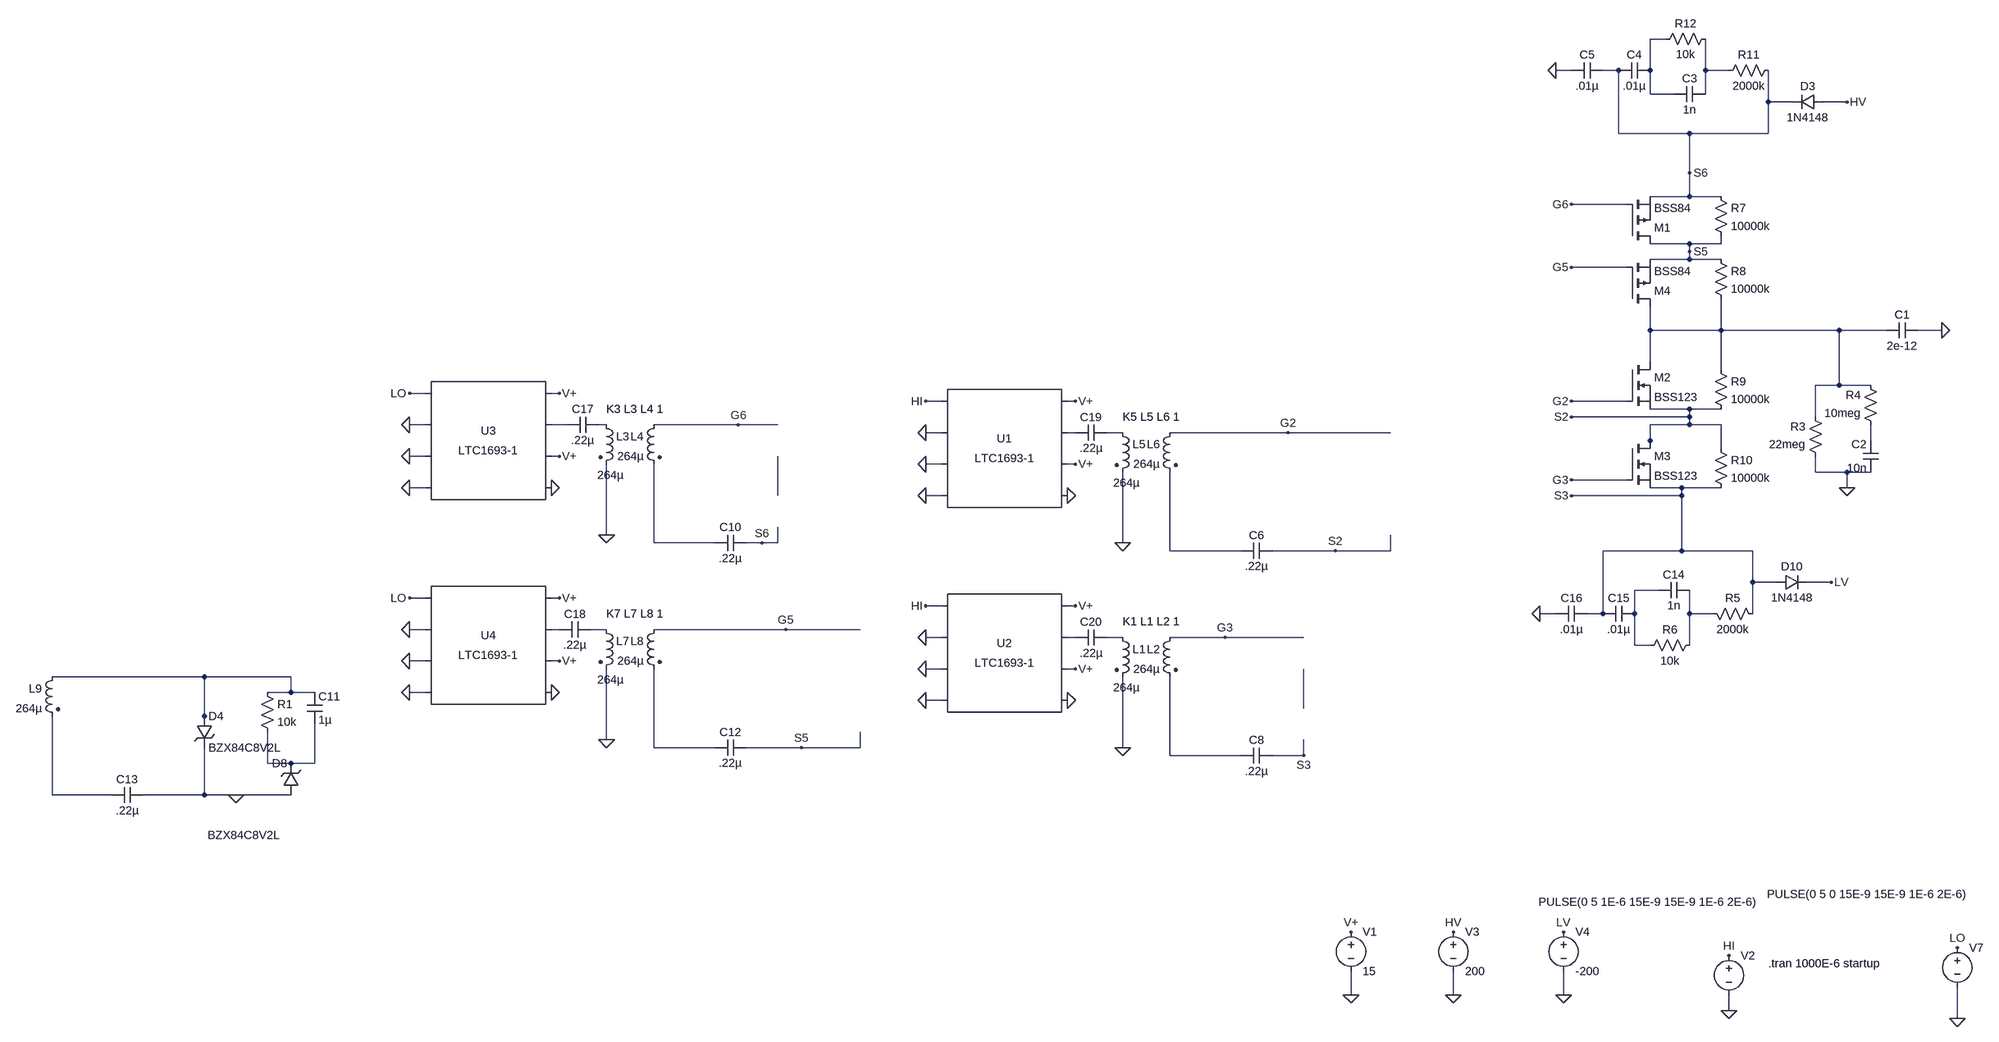
[diagram p0: schematic halfbridge_implant.asc]
halfbridge_implant.asc, the LTspice schematic file:
Version 4
SHEET 1 1824 692
WIRE 16 -2000 -16 -2000
WIRE -176 -1936 -208 -1936
WIRE -80 -1936 -112 -1936
WIRE -16 -1936 -16 -2000
WIRE 96 -1936 96 -2000
WIRE 144 -1936 96 -1936
WIRE -16 -1888 -16 -1936
WIRE 32 -1888 -16 -1888
WIRE 96 -1888 96 -1936
WIRE 224 -1872 224 -1936
WIRE 272 -1872 224 -1872
WIRE 384 -1872 336 -1872
WIRE -80 -1808 -80 -1936
WIRE 64 -1808 -80 -1808
WIRE 224 -1808 224 -1872
WIRE 224 -1808 64 -1808
WIRE 64 -1728 64 -1808
WIRE 64 -1680 64 -1728
WIRE 64 -1680 -16 -1680
WIRE 128 -1680 64 -1680
WIRE -64 -1664 -176 -1664
WIRE 64 -1584 -16 -1584
WIRE 128 -1584 128 -1600
WIRE 128 -1584 64 -1584
WIRE 64 -1568 64 -1584
WIRE 64 -1552 64 -1568
WIRE 64 -1552 -16 -1552
WIRE 128 -1552 64 -1552
WIRE -64 -1536 -176 -1536
WIRE -16 -1408 -16 -1456
WIRE 128 -1408 128 -1472
WIRE 128 -1408 -16 -1408
WIRE 368 -1408 128 -1408
WIRE 464 -1408 368 -1408
WIRE 576 -1408 528 -1408
WIRE -16 -1344 -16 -1408
WIRE 128 -1328 128 -1408
WIRE 368 -1296 368 -1408
WIRE 368 -1296 320 -1296
WIRE 432 -1296 368 -1296
WIRE -2688 -1280 -2720 -1280
WIRE -2416 -1280 -2432 -1280
WIRE -1456 -1264 -1488 -1264
WIRE -1184 -1264 -1200 -1264
WIRE -64 -1264 -176 -1264
WIRE 64 -1248 -16 -1248
WIRE 128 -1248 64 -1248
WIRE 64 -1232 64 -1248
WIRE 64 -1232 -176 -1232
WIRE 320 -1232 320 -1296
WIRE -2688 -1216 -2720 -1216
WIRE -2400 -1216 -2432 -1216
WIRE -2320 -1216 -2336 -1216
WIRE -2032 -1216 -2224 -1216
WIRE -1952 -1216 -2032 -1216
WIRE 64 -1216 64 -1232
WIRE 64 -1216 -16 -1216
WIRE 128 -1216 64 -1216
WIRE -1456 -1200 -1488 -1200
WIRE -1184 -1200 -1200 -1200
WIRE -1088 -1200 -1120 -1200
WIRE -752 -1200 -992 -1200
WIRE -544 -1200 -752 -1200
WIRE -16 -1184 -16 -1216
WIRE 432 -1184 432 -1216
WIRE -16 -1168 -16 -1184
WIRE 128 -1168 128 -1216
WIRE -2688 -1152 -2720 -1152
WIRE -2416 -1152 -2432 -1152
WIRE -1456 -1136 -1488 -1136
WIRE -1184 -1136 -1200 -1136
WIRE 320 -1120 320 -1152
WIRE 384 -1120 320 -1120
WIRE 432 -1120 384 -1120
WIRE -64 -1104 -176 -1104
WIRE -2688 -1088 -2720 -1088
WIRE 48 -1088 -16 -1088
WIRE 128 -1088 48 -1088
WIRE 384 -1088 384 -1120
WIRE -1952 -1072 -1952 -1152
WIRE -1456 -1072 -1488 -1072
WIRE 48 -1072 48 -1088
WIRE 48 -1072 -176 -1072
WIRE -2320 -992 -2320 -1136
WIRE -2224 -976 -2224 -1136
WIRE -2080 -976 -2224 -976
WIRE -1984 -976 -2016 -976
WIRE -1952 -976 -1952 -1008
WIRE -1952 -976 -1984 -976
WIRE -1088 -976 -1088 -1120
WIRE -992 -960 -992 -1120
WIRE -848 -960 -992 -960
WIRE -656 -960 -784 -960
WIRE -544 -960 -544 -992
WIRE -544 -960 -656 -960
WIRE 48 -960 48 -1072
WIRE 48 -960 -112 -960
WIRE 192 -960 48 -960
WIRE 192 -896 192 -960
WIRE 240 -896 192 -896
WIRE 352 -896 304 -896
WIRE 0 -880 -48 -880
WIRE -2688 -864 -2720 -864
WIRE -2416 -864 -2432 -864
WIRE -1456 -848 -1488 -848
WIRE -1184 -848 -1200 -848
WIRE -208 -832 -240 -832
WIRE -112 -832 -112 -960
WIRE -112 -832 -144 -832
WIRE -48 -832 -48 -880
WIRE 64 -832 64 -880
WIRE 112 -832 64 -832
WIRE 192 -832 192 -896
WIRE -2688 -800 -2720 -800
WIRE -2416 -800 -2432 -800
WIRE -2320 -800 -2352 -800
WIRE -1936 -800 -2224 -800
WIRE -1776 -800 -1936 -800
WIRE -1456 -784 -1488 -784
WIRE -1184 -784 -1200 -784
WIRE -1088 -784 -1120 -784
WIRE -880 -784 -992 -784
WIRE -720 -784 -880 -784
WIRE -48 -768 -48 -832
WIRE -16 -768 -48 -768
WIRE 64 -768 64 -832
WIRE -2688 -736 -2720 -736
WIRE -2416 -736 -2432 -736
WIRE -1456 -720 -1488 -720
WIRE -1184 -720 -1200 -720
WIRE -3232 -704 -3568 -704
WIRE -3056 -704 -3232 -704
WIRE -3056 -672 -3056 -704
WIRE -3056 -672 -3104 -672
WIRE -3008 -672 -3056 -672
WIRE -2688 -672 -2720 -672
WIRE -1456 -656 -1488 -656
WIRE -720 -640 -720 -720
WIRE -3232 -624 -3232 -704
WIRE -3232 -608 -3232 -624
WIRE -2320 -576 -2320 -720
WIRE -2224 -560 -2224 -720
WIRE -2080 -560 -2224 -560
WIRE -1904 -560 -2016 -560
WIRE -1776 -560 -1776 -592
WIRE -1776 -560 -1904 -560
WIRE -1088 -560 -1088 -704
WIRE -992 -544 -992 -704
WIRE -848 -544 -992 -544
WIRE -720 -544 -720 -576
WIRE -720 -544 -784 -544
WIRE -3104 -528 -3104 -592
WIRE -3056 -528 -3104 -528
WIRE -3008 -528 -3008 -608
WIRE -3008 -528 -3056 -528
WIRE -3568 -464 -3568 -624
WIRE -3424 -464 -3568 -464
WIRE -3232 -464 -3232 -560
WIRE -3232 -464 -3360 -464
WIRE -3168 -464 -3232 -464
WIRE -3056 -464 -3168 -464
WIRE -624 176 -624 128
WIRE -416 176 -416 128
WIRE -192 176 -192 128
WIRE 144 208 144 176
WIRE 608 224 608 160
FLAG -416 176 0
FLAG -416 48 HV
FLAG -192 176 0
FLAG -192 48 LV
FLAG -624 176 0
FLAG -624 48 V+
FLAG 144 208 0
FLAG 608 224 0
FLAG 144 96 HI
FLAG 608 80 LO
FLAG -1488 -1264 HI
FLAG -1184 -1264 V+
FLAG -1088 -976 0
FLAG -1184 -1136 V+
FLAG -1488 -1200 0
FLAG -1488 -1072 0
FLAG -1488 -1136 0
FLAG -1200 -1072 0
FLAG 576 -1408 0
FLAG -208 -1936 0
FLAG 384 -1872 HV
FLAG -1488 -848 HI
FLAG -1184 -848 V+
FLAG -1088 -560 0
FLAG -1184 -720 V+
FLAG -1488 -784 0
FLAG -1488 -656 0
FLAG -1488 -720 0
FLAG -1200 -656 0
FLAG -2416 -1280 V+
FLAG -2320 -992 0
FLAG -2416 -1152 V+
FLAG -2720 -1216 0
FLAG -2720 -1088 0
FLAG -2720 -1152 0
FLAG -2432 -1088 0
FLAG -2416 -864 V+
FLAG -2320 -576 0
FLAG -2416 -736 V+
FLAG -2720 -800 0
FLAG -2720 -672 0
FLAG -2720 -736 0
FLAG -2432 -672 0
FLAG 384 -1088 0
FLAG -240 -832 0
FLAG 352 -896 LV
FLAG -176 -1264 G2
FLAG -176 -1104 G3
FLAG -176 -1232 S2
FLAG -176 -1072 S3
FLAG -176 -1536 G5
FLAG -176 -1664 G6
FLAG 64 -1728 S6
FLAG 64 -1568 S5
FLAG -2720 -1280 LO
FLAG -2720 -864 LO
FLAG -3168 -464 0
FLAG -2032 -1216 G6
FLAG -1984 -976 S6
FLAG -880 -784 G3
FLAG -720 -544 S3
FLAG -1936 -800 G5
FLAG -1904 -560 S5
FLAG -752 -1200 G2
FLAG -656 -960 S2
SYMBOL voltage -416 32 R0
WINDOW 123 0 0 Left 2
WINDOW 39 0 0 Left 2
SYMATTR InstName V3
SYMATTR Value 200
SYMBOL voltage -192 32 R0
WINDOW 123 0 0 Left 2
WINDOW 39 0 0 Left 2
SYMATTR InstName V4
SYMATTR Value -200
SYMBOL ind2 -1104 -1216 R0
WINDOW 3 -3 118 Left 2
SYMATTR Value 264µ
SYMATTR InstName L5
SYMATTR SpiceLine Rser=.4
SYMBOL ind2 -976 -1216 M0
SYMATTR InstName L6
SYMATTR Value 264µ
SYMATTR SpiceLine Ipk=.09 Rser=.4
SYMBOL voltage -624 32 R0
WINDOW 123 0 0 Left 2
WINDOW 39 0 0 Left 2
SYMATTR InstName V1
SYMATTR Value 15
SYMBOL voltage 144 80 R0
WINDOW 3 -387 -93 Left 2
WINDOW 123 0 0 Left 2
WINDOW 39 0 0 Left 2
SYMATTR Value PULSE(0 5 1E-6 15E-9 15E-9 1E-6 2E-6)
SYMATTR InstName V2
SYMBOL voltage 608 64 R0
WINDOW 3 -387 -93 Left 2
WINDOW 123 0 0 Left 2
WINDOW 39 0 0 Left 2
SYMATTR Value PULSE(0 5 0 15E-9 15E-9 1E-6 2E-6)
SYMATTR InstName V7
SYMBOL PowerProducts\\LTC1693-1 -1328 -1168 R0
SYMATTR InstName U1
SYMBOL nmos -64 -1344 R0
SYMATTR InstName M2
SYMATTR Value BSS123
SYMBOL nmos -64 -1184 R0
SYMATTR InstName M3
SYMATTR Value BSS123
SYMBOL cap 464 -1392 R270
WINDOW 0 32 32 VTop 2
WINDOW 3 0 32 VBottom 2
SYMATTR InstName C1
SYMATTR Value 2e-12
SYMBOL res 112 -1696 R0
SYMATTR InstName R7
SYMATTR Value 10000k
SYMBOL res 112 -1568 R0
SYMATTR InstName R8
SYMATTR Value 10000k
SYMBOL res 112 -1344 R0
SYMATTR InstName R9
SYMATTR Value 10000k
SYMBOL res 112 -1184 R0
SYMATTR InstName R10
SYMATTR Value 10000k
SYMBOL diode 336 -1888 R90
WINDOW 0 0 32 VBottom 2
WINDOW 3 32 32 VTop 2
SYMATTR InstName D3
SYMATTR Value 1N4148
SYMBOL res 240 -1952 R90
WINDOW 0 0 56 VBottom 2
WINDOW 3 32 56 VTop 2
SYMATTR InstName R11
SYMATTR Value 2000k
SYMBOL res 112 -2016 R90
WINDOW 0 0 56 VBottom 2
WINDOW 3 32 56 VTop 2
SYMATTR InstName R12
SYMATTR Value 10k
SYMBOL cap 96 -1904 R90
WINDOW 0 0 32 VBottom 2
WINDOW 3 32 32 VTop 2
SYMATTR InstName C3
SYMATTR Value 1n
SYMBOL cap -16 -1952 R90
WINDOW 0 0 32 VBottom 2
WINDOW 3 32 32 VTop 2
SYMATTR InstName C4
SYMATTR Value .01µ
SYMBOL cap -112 -1952 R90
WINDOW 0 0 32 VBottom 2
WINDOW 3 32 32 VTop 2
SYMATTR InstName C5
SYMATTR Value .01µ
SYMBOL cap -784 -976 R90
WINDOW 0 0 32 VBottom 2
WINDOW 3 32 32 VTop 2
SYMATTR InstName C6
SYMATTR Value .22µ
SYMBOL ind2 -1104 -800 R0
WINDOW 3 -3 118 Left 2
SYMATTR Value 264µ
SYMATTR InstName L1
SYMATTR SpiceLine Rser=.4
SYMBOL ind2 -976 -800 M0
SYMATTR InstName L2
SYMATTR Value 264µ
SYMATTR SpiceLine Ipk=.09 Rser=.4
SYMBOL PowerProducts\\LTC1693-1 -1328 -752 R0
SYMATTR InstName U2
SYMBOL cap -784 -560 R90
WINDOW 0 0 32 VBottom 2
WINDOW 3 32 32 VTop 2
SYMATTR InstName C8
SYMATTR Value .22µ
SYMBOL ind2 -2336 -1232 R0
WINDOW 3 -3 118 Left 2
SYMATTR Value 264µ
SYMATTR InstName L3
SYMATTR SpiceLine Rser=.4
SYMBOL ind2 -2208 -1232 M0
SYMATTR InstName L4
SYMATTR Value 264µ
SYMATTR SpiceLine Ipk=.09 Rser=.4
SYMBOL PowerProducts\\LTC1693-1 -2560 -1184 R0
SYMATTR InstName U3
SYMBOL cap -2016 -992 R90
WINDOW 0 0 32 VBottom 2
WINDOW 3 32 32 VTop 2
SYMATTR InstName C10
SYMATTR Value .22µ
SYMBOL ind2 -2336 -816 R0
WINDOW 3 -3 118 Left 2
SYMATTR Value 264µ
SYMATTR InstName L7
SYMATTR SpiceLine Rser=.4
SYMBOL ind2 -2208 -816 M0
SYMATTR InstName L8
SYMATTR Value 264µ
SYMATTR SpiceLine Ipk=.09 Rser=.4
SYMBOL PowerProducts\\LTC1693-1 -2560 -768 R0
SYMATTR InstName U4
SYMBOL cap -2016 -576 R90
WINDOW 0 0 32 VBottom 2
WINDOW 3 32 32 VTop 2
SYMATTR InstName C12
SYMATTR Value .22µ
SYMBOL res 336 -1136 R180
WINDOW 0 36 76 Left 2
WINDOW 3 36 40 Left 2
SYMATTR InstName R3
SYMATTR Value 22meg
SYMBOL cap 448 -1120 R180
WINDOW 0 24 56 Left 2
WINDOW 3 24 8 Left 2
SYMATTR InstName C2
SYMATTR Value 10n
SYMBOL res 448 -1200 R180
WINDOW 0 36 76 Left 2
WINDOW 3 36 40 Left 2
SYMATTR InstName R4
SYMATTR Value 10meg
SYMBOL diode 240 -880 R270
WINDOW 0 32 32 VTop 2
WINDOW 3 0 32 VBottom 2
SYMATTR InstName D10
SYMATTR Value 1N4148
SYMBOL res 208 -816 M270
WINDOW 0 32 56 VTop 2
WINDOW 3 0 56 VBottom 2
SYMATTR InstName R5
SYMATTR Value 2000k
SYMBOL cap 64 -864 M270
WINDOW 0 32 32 VTop 2
WINDOW 3 0 32 VBottom 2
SYMATTR InstName C14
SYMATTR Value 1n
SYMBOL cap -48 -816 M270
WINDOW 0 32 32 VTop 2
WINDOW 3 0 32 VBottom 2
SYMATTR InstName C15
SYMATTR Value .01µ
SYMBOL cap -144 -816 M270
WINDOW 0 32 32 VTop 2
WINDOW 3 0 32 VBottom 2
SYMATTR InstName C16
SYMATTR Value .01µ
SYMBOL res 80 -784 R90
WINDOW 0 0 56 VBottom 2
WINDOW 3 32 56 VTop 2
SYMATTR InstName R6
SYMATTR Value 10k
SYMBOL cap -2336 -1232 R90
WINDOW 0 0 32 VBottom 2
WINDOW 3 32 32 VTop 2
SYMATTR InstName C17
SYMATTR Value .22µ
SYMBOL cap -2352 -816 R90
WINDOW 0 0 32 VBottom 2
WINDOW 3 32 32 VTop 2
SYMATTR InstName C18
SYMATTR Value .22µ
SYMBOL cap -1120 -1216 R90
WINDOW 0 0 32 VBottom 2
WINDOW 3 32 32 VTop 2
SYMATTR InstName C19
SYMATTR Value .22µ
SYMBOL cap -1120 -800 R90
WINDOW 0 0 32 VBottom 2
WINDOW 3 32 32 VTop 2
SYMATTR InstName C20
SYMATTR Value .22µ
SYMBOL zener -3248 -624 R0
SYMATTR InstName D4
SYMATTR Value BZX84C8V2L
SYMATTR Description Diode
SYMATTR Type diode
SYMBOL zener -3040 -464 R180
WINDOW 0 24 64 Left 2
WINDOW 3 38 -82 Left 2
SYMATTR InstName D8
SYMATTR Value BZX84C8V2L
SYMATTR Description Diode
SYMATTR Type diode
SYMBOL res -3120 -688 R0
SYMATTR InstName R1
SYMATTR Value 10k
SYMBOL cap -3024 -672 R0
SYMATTR InstName C11
SYMATTR Value 1µ
SYMBOL ind2 -3552 -720 M0
SYMATTR InstName L9
SYMATTR Value 264µ
SYMATTR SpiceLine Ipk=.09 Rser=.4
SYMBOL cap -3360 -480 R90
WINDOW 0 0 32 VBottom 2
WINDOW 3 32 32 VTop 2
SYMATTR InstName C13
SYMATTR Value .22µ
SYMBOL pmos -64 -1584 M180
SYMATTR InstName M1
SYMATTR Value BSS84
SYMBOL pmos -64 -1456 M180
SYMATTR InstName M4
SYMATTR Value BSS84
TEXT -1088 -1232 Left 2 !K5 L5 L6 1
TEXT 224 112 Left 2 !.tran 1000E-6 startup
TEXT -1088 -816 Left 2 !K1 L1 L2 1
TEXT -2320 -1248 Left 2 !K3 L3 L4 1
TEXT -2320 -832 Left 2 !K7 L7 L8 1

The netlist it stands for:
* halfbridge_implant.asc
V3 HV 0 200
V4 LV 0 -200
L5 N007 0 264µ Rser=.4
L6 G2 N011 264µ Ipk=.09 Rser=.4
V1 V+ 0 15
V2 HI 0 PULSE(0 5 1E-6 15E-9 15E-9 1E-6 2E-6)
V7 LO 0 PULSE(0 5 0 15E-9 15E-9 1E-6 2E-6)
XU1 HI 0 0 0 0 V+ N006 V+ LTC1693-1
M2 N003 G2 S2 S2 BSS123
M3 S2 G3 S3 S3 BSS123
C1 N003 0 2e-12
R7 S6 S5 10000k
R8 S5 N003 10000k
R9 N003 S2 10000k
R10 S2 S3 10000k
D3 HV S6 1N4148
R11 S6 N002 2000k
R12 N002 N001 10k
C3 N002 N001 1n
C4 N001 S6 .01µ
C5 S6 0 .01µ
C6 S2 N011 .22µ
L1 N017 0 264µ Rser=.4
L2 G3 N021 264µ Ipk=.09 Rser=.4
XU2 HI 0 0 0 0 V+ N016 V+ LTC1693-1
C8 S3 N021 .22µ
L3 N005 0 264µ Rser=.4
L4 G6 N010 264µ Ipk=.09 Rser=.4
XU3 LO 0 0 0 0 V+ N004 V+ LTC1693-1
C10 S6 N010 .22µ
L7 N015 0 264µ Rser=.4
L8 G5 N020 264µ Ipk=.09 Rser=.4
XU4 LO 0 0 0 0 V+ N014 V+ LTC1693-1
C12 S5 N020 .22µ
R3 0 N003 22meg
C2 0 N008 10n
R4 N008 N003 10meg
D10 S3 LV 1N4148
R5 S3 N013 2000k
C14 N013 N012 1n
C15 N012 S3 .01µ
C16 S3 0 .01µ
R6 N013 N012 10k
C17 N005 N004 .22µ
C18 N015 N014 .22µ
C19 N007 N006 .22µ
C20 N017 N016 .22µ
D4 N018 0 BZX84C8V2L
D8 0 N022 BZX84C8V2L
R1 N018 N022 10k
C11 N018 N022 1µ
L9 N018 N023 264µ Ipk=.09 Rser=.4
C13 0 N023 .22µ
M1 S5 G6 S6 S6 BSS84
M4 N003 G5 S5 S5 BSS84
.model D D
.lib standard.dio
.model NMOS NMOS
.model PMOS PMOS
.lib standard.mos
K5 L5 L6 1
.tran 1000E-6 startup
K1 L1 L2 1
K3 L3 L4 1
K7 L7 L8 1
.lib LTC1693-1.sub
.backanno
.end